# EAGLE design mezza (EAGLE 9.5.2)

## Sheet 1 of 5
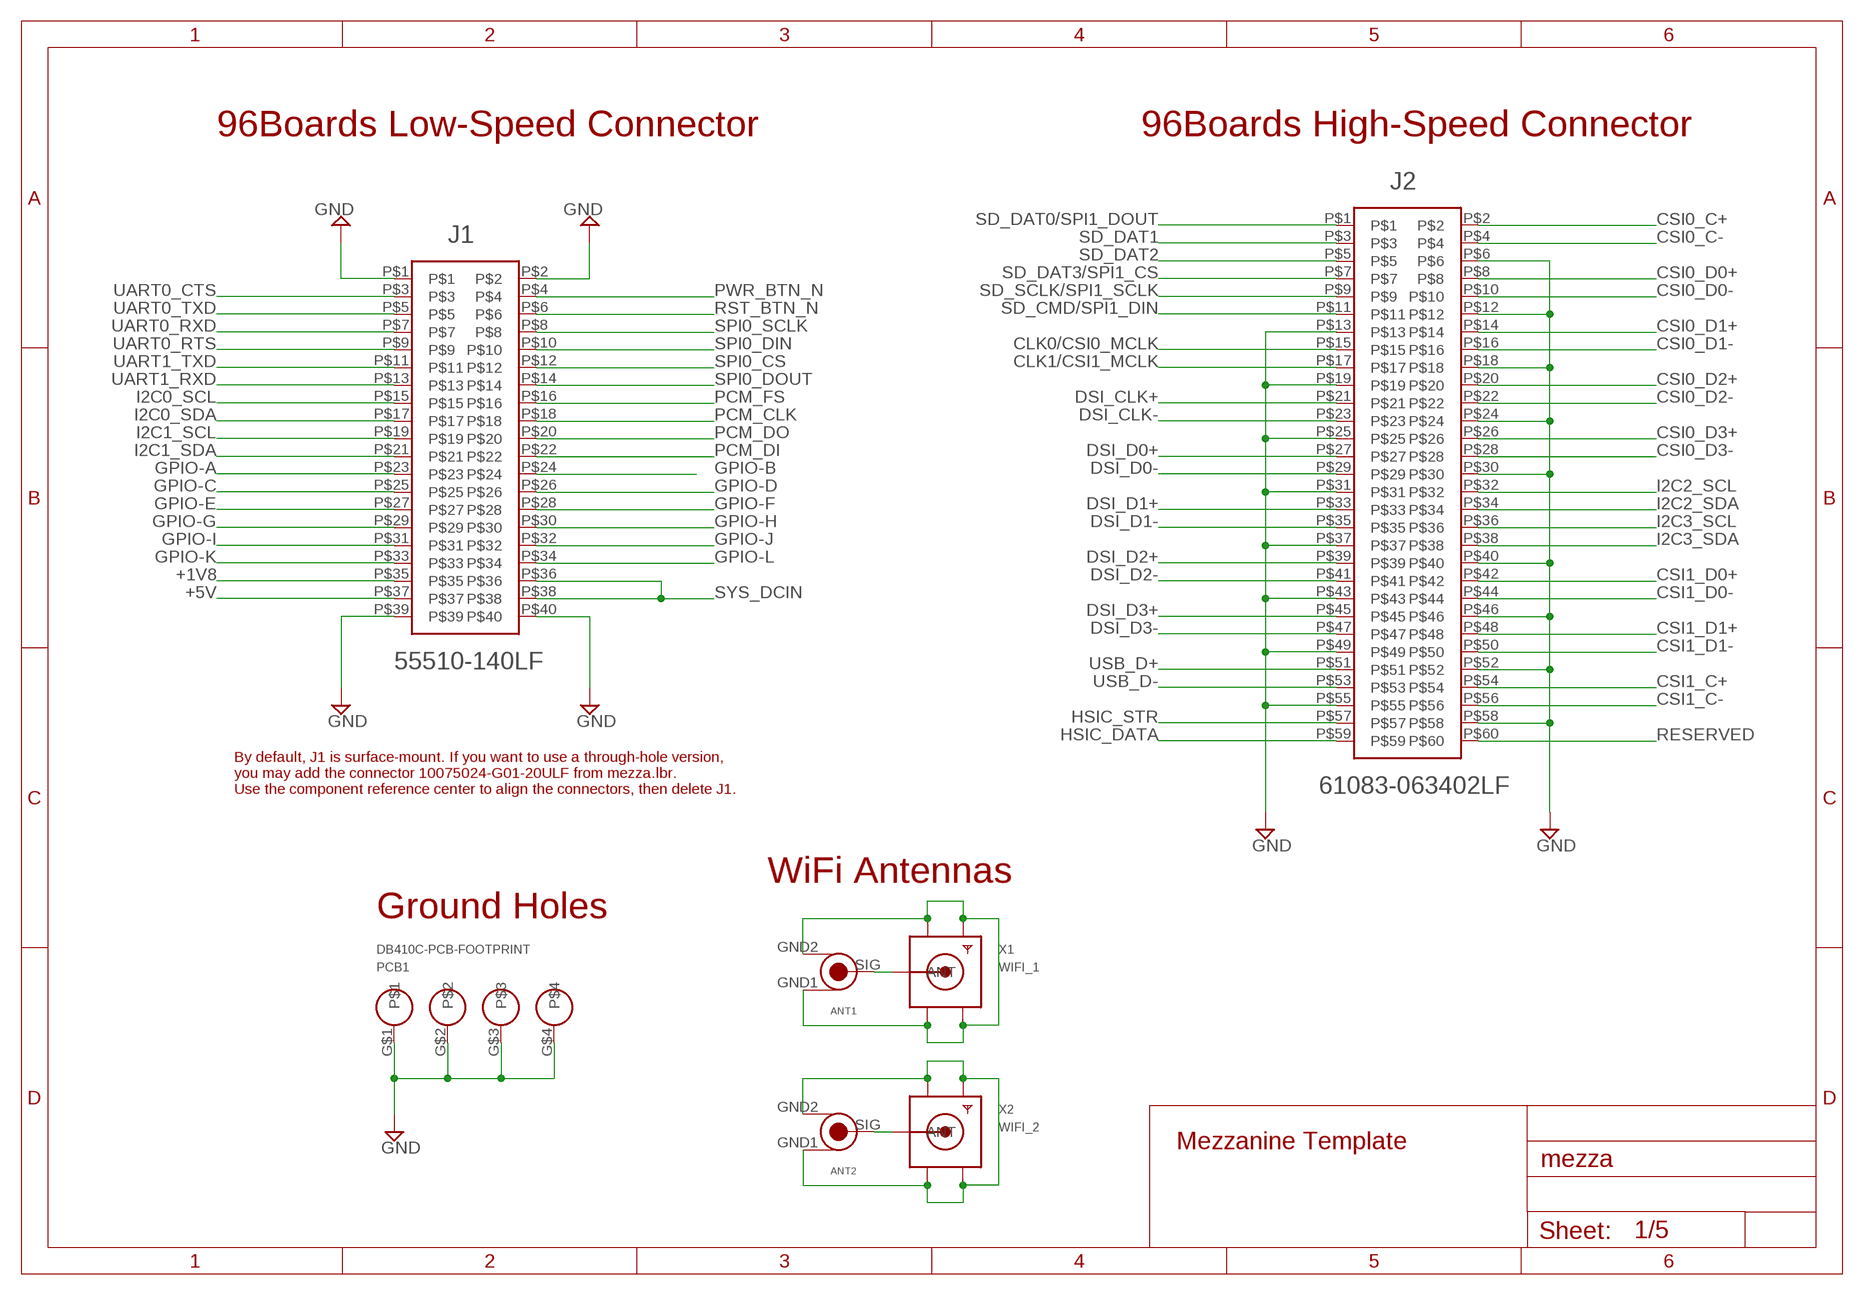
[diagram p0: schematic, sheet 1]

### Parts
ANT1  GHI-CONNECTORS_U.FL-R-SMT-1  [GHI-CONNECTORS_U.FL-R-SMT-1]
ANT2  GHI-CONNECTORS_U.FL-R-SMT-1  [GHI-CONNECTORS_U.FL-R-SMT-1]
J1  55510-140LF  [55510-140LF]
J2  61083-063402LF  [61083-063402LF]
PCB1  DB410C-PCB-FOOTPRINT  [DRAGONBOARD410C]
X1  WIFI_1  SMACONNECTOR_EDGE  [SMA_EDGELAUNCH]
X2  WIFI_2  SMACONNECTOR_EDGE  [SMA_EDGELAUNCH]

### Nets
+1V8: J1.P$35 ; also sheet 3,4,5
+5V: J1.P$37 ; also sheet 2,3,4,5
CLK0/CSI0_MCLK: J2.P$15
CLK1/CSI1_MCLK: J2.P$17
CSI0_C+: J2.P$2
CSI0_C-: J2.P$4
CSI0_D0+: J2.P$8
CSI0_D0-: J2.P$10
CSI0_D1+: J2.P$14
CSI0_D1-: J2.P$16
CSI0_D2+: J2.P$20
CSI0_D2-: J2.P$22
CSI0_D3+: J2.P$26
CSI0_D3-: J2.P$28
CSI1_C+: J2.P$54
CSI1_C-: J2.P$56
CSI1_D0+: J2.P$42
CSI1_D0-: J2.P$44
CSI1_D1+: J2.P$48
CSI1_D1-: J2.P$50
DSI_CLK+: J2.P$21
DSI_CLK-: J2.P$23
DSI_D0+: J2.P$27
DSI_D0-: J2.P$29
DSI_D1+: J2.P$33
DSI_D1-: J2.P$35
DSI_D2+: J2.P$39
DSI_D2-: J2.P$41
DSI_D3+: J2.P$45
DSI_D3-: J2.P$47
GND: J1.P$1 J1.P$2 J1.P$39 J1.P$40 J2.P$6 J2.P$12 J2.P$13 J2.P$18 J2.P$19 J2.P$24 J2.P$25 J2.P$30 J2.P$31 J2.P$37 J2.P$40 J2.P$43 J2.P$46 J2.P$49 J2.P$52 J2.P$55 J2.P$58 PCB1.G$1 PCB1.G$2 PCB1.G$3 PCB1.G$4 ; also sheet 2,3,4,5
GPIO-A: J1.P$23
GPIO-B: J1.P$24
GPIO-C: J1.P$25
GPIO-D: J1.P$26
GPIO-E: J1.P$27
GPIO-F: J1.P$28
GPIO-G: J1.P$29 ; also sheet 5
GPIO-H: J1.P$30
GPIO-I: J1.P$31 ; also sheet 5
GPIO-J: J1.P$32 ; also sheet 5
GPIO-K: J1.P$33 ; also sheet 5
GPIO-L: J1.P$34 ; also sheet 5
HSIC_DATA: J2.P$59
HSIC_STR: J2.P$57
I2C0_SCL: J1.P$15
I2C0_SDA: J1.P$17
I2C1_SCL: J1.P$19 ; also sheet 3
I2C1_SDA: J1.P$21 ; also sheet 3
I2C2_SCL: J2.P$32
I2C2_SDA: J2.P$34
I2C3_SCL: J2.P$36
I2C3_SDA: J2.P$38
N$2: ANT1.SIG X1.P(ANT)
N$10: ANT2.SIG X2.P(ANT)
N$12: ANT2.GND1 ANT2.GND2 X2.GND@1(GND4) X2.GND@2(GND3) X2.GND@3(GND2) X2.GND@4(GND1)
N$14: ANT1.GND1 ANT1.GND2 X1.GND@1(GND4) X1.GND@2(GND3) X1.GND@3(GND2) X1.GND@4(GND1)
PCM_CLK: J1.P$18
PCM_DI: J1.P$22
PCM_DO: J1.P$20
PCM_FS: J1.P$16
PWR_BTN_N: J1.P$4
RESERVED: J2.P$60
RST_BTN_N: J1.P$6 ; also sheet 5
SD_CMD/SPI1_DIN: J2.P$11
SD_DAT0/SPI1_DOUT: J2.P$1
SD_DAT1: J2.P$3
SD_DAT2: J2.P$5
SD_DAT3/SPI1_CS: J2.P$7
SD_SCLK/SPI1_SCLK: J2.P$9
SPI0_CS: J1.P$12 ; also sheet 5
SPI0_DIN: J1.P$10 ; also sheet 5
SPI0_DOUT: J1.P$14 ; also sheet 5
SPI0_SCLK: J1.P$8 ; also sheet 5
SYS_DCIN: J1.P$36 J1.P$38 ; also sheet 2
UART0_CTS: J1.P$3
UART0_RTS: J1.P$9
UART0_RXD: J1.P$7 ; also sheet 4
UART0_TXD: J1.P$5 ; also sheet 4
UART1_RXD: J1.P$13 ; also sheet 4
UART1_TXD: J1.P$11 ; also sheet 4
USB_D+: J2.P$51
USB_D-: J2.P$53

### Notes on the sheet
- 96Boards Low-Speed Connector | 96Boards High-Speed Connector
- By default, J1 is surface-mount. If you want to use a through-hole version, 
  you may add the connector 10075024-G01-20ULF from mezza.lbr.
  Use the component reference center to align the connectors, then delete J1.
- WiFi Antennas
- Ground Holes
- Mezzanine Template

## Sheet 2 of 5
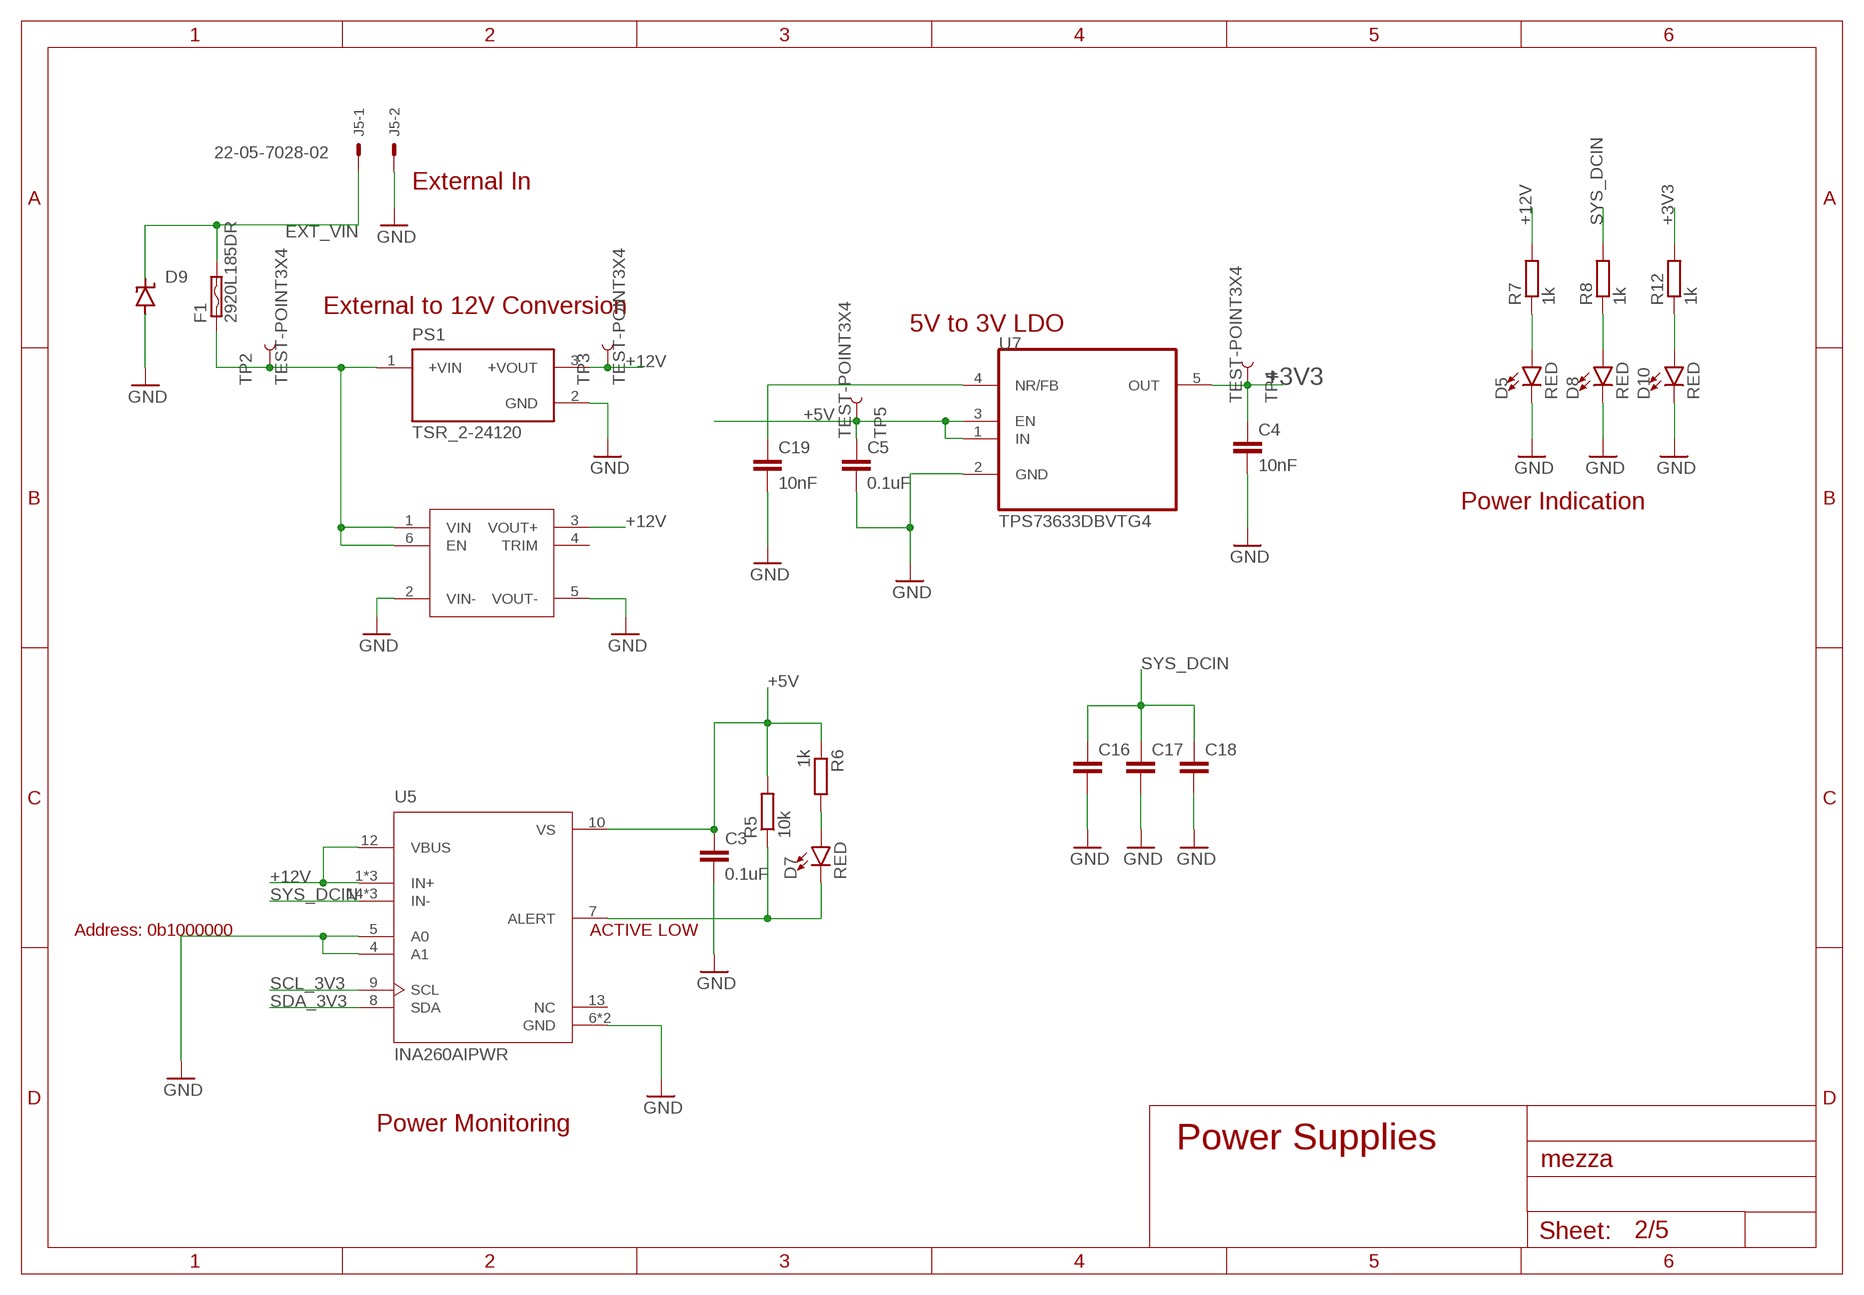
[diagram p1: schematic, sheet 2]

### Parts
C3  0.1uF  0.1UF-0603-25V-(+80/-20%)  [0603]
C4  10nF  C-EUC0603  [C0603]
C5  0.1uF  C-EUC0603  [C0603]
C16  C-EUC1206  [C1206]
C17  C-EUC1206  [C1206]
C18  C-EUC1206  [C1206]
C19  10nF  C-EUC0603  [C0603]
D5  RED  LED-RED0603  [LED-0603]
D7  RED  LED-RED0603  [LED-0603]
D8  RED  LED-RED0603  [LED-0603]
D9  SUPPRESSOR-SMBJ  [SMBJ]
D10  RED  LED-RED0603  [LED-0603]
F1  2920L185DR  2920L200  [SMD050F]
J5  22-05-7028-02  [7395-02]
PS1  TSR_2-24120  [CONV_TSR_2-24120]
R5  10k  R-EU_R0603  [R0603]
R6  1k  R-EU_R0603  [R0603]
R7  1k  R-EU_R0603  [R0603]
R8  1k  R-EU_R0603  [R0603]
R12  1k  R-EU_R0603  [R0603]
TP2  TEST-POINT3X4  [PAD.03X.04]
TP3  TEST-POINT3X4  [PAD.03X.04]
TP4  TEST-POINT3X4  [PAD.03X.04]
TP5  TEST-POINT3X4  [PAD.03X.04]
U5  INA260AIPWR  [SOP65P640X120-16N]
U7  TPS73633DBVTG4  [SOT23-5]
U$2  THN15-2422/3  THN15-2411  [TRACOTHN]

### Nets
+3V3: C4.1 R12.2 TP4.P$1 U7.5(OUT) ; also sheet 3,4
+5V: C3.1 C5.1 R5.2 R6.1 TP5.P$1 U5.10(VS) U7.1(IN) U7.3(EN) ; also sheet 1,3,4,5
+12V: PS1.3(+VOUT) R7.2 TP3.P$1 U5.1(IN+) U5.2(IN+) U5.3(IN+) U5.12(VBUS) U$2.3(VOUT+)
EXT_VIN: D9.C F1.2 J5.1
GND: C3.2 C4.2 C5.2 C16.2 C17.2 C18.2 C19.2 D5.C D8.C D9.A D10.C J5.2 PS1.2(GND) U5.4(A1) U5.5(A0) U5.6(GND) U5.11(GND) U7.2(GND) U$2.2(VIN-) U$2.5(VOUT-) ; also sheet 1,3,4,5
N$1: D7.C R5.1 U5.7(ALERT)
N$7: D7.A R6.2
N$13: D5.A R7.1
N$15: D8.A R8.1
N$16: C19.1 U7.4(NR/FB)
N$17: D10.A R12.1
N$27: F1.1 PS1.1(+VIN) TP2.P$1 U$2.1(VIN) U$2.6(EN)
SCL_3V3: U5.9(SCL) ; also sheet 3
SDA_3V3: U5.8(SDA) ; also sheet 3
SYS_DCIN: C16.1 C17.1 C18.1 R8.2 U5.14(IN-) U5.15(IN-) U5.16(IN-) ; also sheet 1
Unconnected: U5.13(NC) U$2.4(TRIM)

### Notes on the sheet
- External In
- External to 12V Conversion
- 5V to 3V LDO
- Power Indication
- Address: 0b1000000 | ACTIVE LOW
- Power Monitoring
- Power Supplies

## Sheet 3 of 5
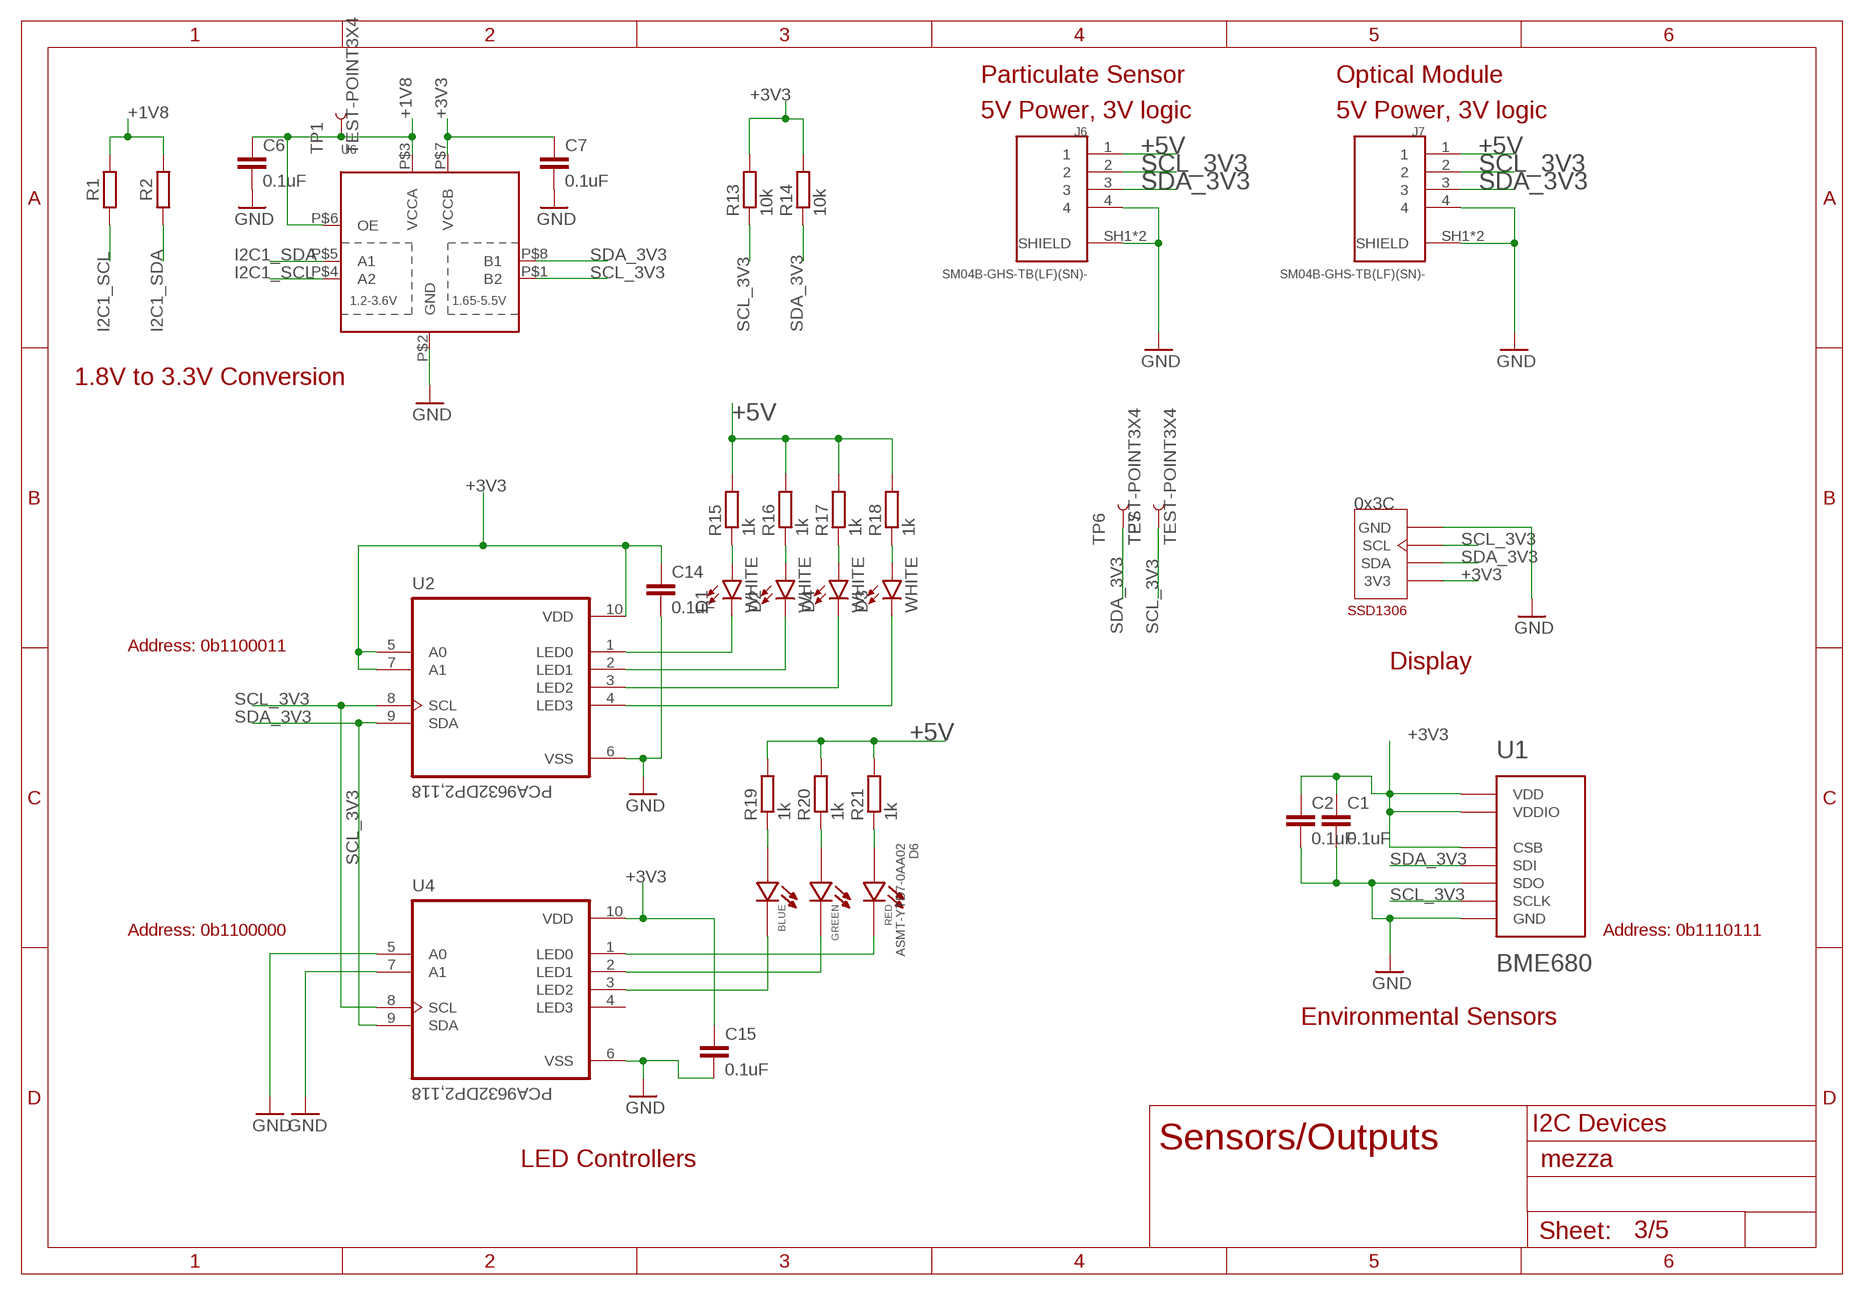
[diagram p2: schematic, sheet 3]

### Parts
C1  0.1uF  0.1UF-0603-25V-(+80/-20%)  [0603]
C2  0.1uF  0.1UF-0603-25V-(+80/-20%)  [0603]
C6  0.1uF  0.1UF-0603-25V-(+80/-20%)  [0603]
C7  0.1uF  0.1UF-0603-25V-(+80/-20%)  [0603]
C14  0.1uF  0.1UF-0603-25V-(+80/-20%)  [0603]
C15  0.1uF  0.1UF-0603-25V-(+80/-20%)  [0603]
D1  WHITE  LED-WHITE0603  [LED-0603]
D2  WHITE  LED-WHITE0603  [LED-0603]
D3  WHITE  LED-WHITE0603  [LED-0603]
D4  WHITE  LED-WHITE0603  [LED-0603]
D6  ASMT-YTD7-0AA02  [LED_ASMT-YTD7-0AA02]
J6  SM04B-GHS-TB(LF)(SN)-  [JST_SM04B-GHS-TB(LF)(SN)-]
J7  SM04B-GHS-TB(LF)(SN)-  [JST_SM04B-GHS-TB(LF)(SN)-]
R1  10k  R-EU_R0603  [R0603]
R2  10k  R-EU_R0603  [R0603]
R13  10k  R-EU_R0603  [R0603]
R14  10k  R-EU_R0603  [R0603]
R15  1k  R-EU_R0603  [R0603]
R16  1k  R-EU_R0603  [R0603]
R17  1k  R-EU_R0603  [R0603]
R18  1k  R-EU_R0603  [R0603]
R19  1k  R-EU_R0603  [R0603]
R20  1k  R-EU_R0603  [R0603]
R21  1k  R-EU_R0603  [R0603]
TP1  TEST-POINT3X4  [PAD.03X.04]
TP6  TEST-POINT3X4  [PAD.03X.04]
TP7  TEST-POINT3X4  [PAD.03X.04]
U1  BME680  [LGA-8]
U2  PCA9632DP2,118  [SOP50P490X110-10N]
U4  PCA9632DP2,118  [SOP50P490X110-10N]
U6  TXS0102  [VFSOP-8]
U$1  SSD1306  [128_32_OLED]

### Nets
+1V8: C6.1 R1.2 R2.2 TP1.P$1 U6.P$3(VCCA) U6.P$6(OE) ; also sheet 1,4,5
+3V3: C1.1 C2.1 C7.1 C14.1 C15.1 R13.2 R14.2 U1.2(CSB) U1.6(VDDIO) U1.8(VDD) U2.5(A0) U2.7(A1) U2.10(VDD) U4.10(VDD) U6.P$7(VCCB) U$1.3V3 ; also sheet 2,4
+5V: J6.1 J7.1 R15.2 R16.2 R17.2 R18.2 R19.2 R20.2 R21.2 ; also sheet 1,2,4,5
GND: C1.2 C2.2 C6.2 C7.2 C14.2 C15.2 J6.4 J6.SH1(SHIELD) J6.SH2(SHIELD) J7.4 J7.SH1(SHIELD) J7.SH2(SHIELD) U1.1(GND) U1.5(SDO) U1.7(GND) U2.6(VSS) U4.5(A0) U4.6(VSS) U4.7(A1) U6.P$2(GND) U$1.GND ; also sheet 1,2,4,5
I2C1_SCL: R1.1 U6.P$4(A2) ; also sheet 1
I2C1_SDA: R2.1 U6.P$5(A1) ; also sheet 1
N$3: D1.A R15.1
N$4: D2.A R16.1
N$5: D4.A R17.1
N$6: D3.A R18.1
N$8: D6.6(B_A) R19.1
N$9: D6.5(G_A) R20.1
N$11: D6.4(R_A) R21.1
N$21: D1.C U2.1(LED0)
N$22: D2.C U2.2(LED1)
N$25: D4.C U2.3(LED2)
N$26: D3.C U2.4(LED3)
N$28: D6.1(B_C) U4.3(LED2)
N$29: D6.2(G_C) U4.2(LED1)
N$30: D6.3(R_C) U4.1(LED0)
SCL_3V3: J6.2 J7.2 R13.1 TP7.P$1 U1.4(SCLK) U2.8(SCL) U4.8(SCL) U6.P$1(B2) U$1.SCL ; also sheet 2
SDA_3V3: J6.3 J7.3 R14.1 TP6.P$1 U1.3(SDI) U2.9(SDA) U4.9(SDA) U6.P$8(B1) U$1.SDA ; also sheet 2
Unconnected: U4.4(LED3)

### Notes on the sheet
- Particulate Sensor | Optical Module
- 5V Power, 3V logic | 5V Power, 3V logic
- 1.8V to 3.3V Conversion
- 0x3C
- Address: 0b1100011
- Display
- Address: 0b1100000 | Address: 0b1110111
- Environmental Sensors
- I2C Devices
- LED Controllers | Sensors/Outputs

## Sheet 4 of 5
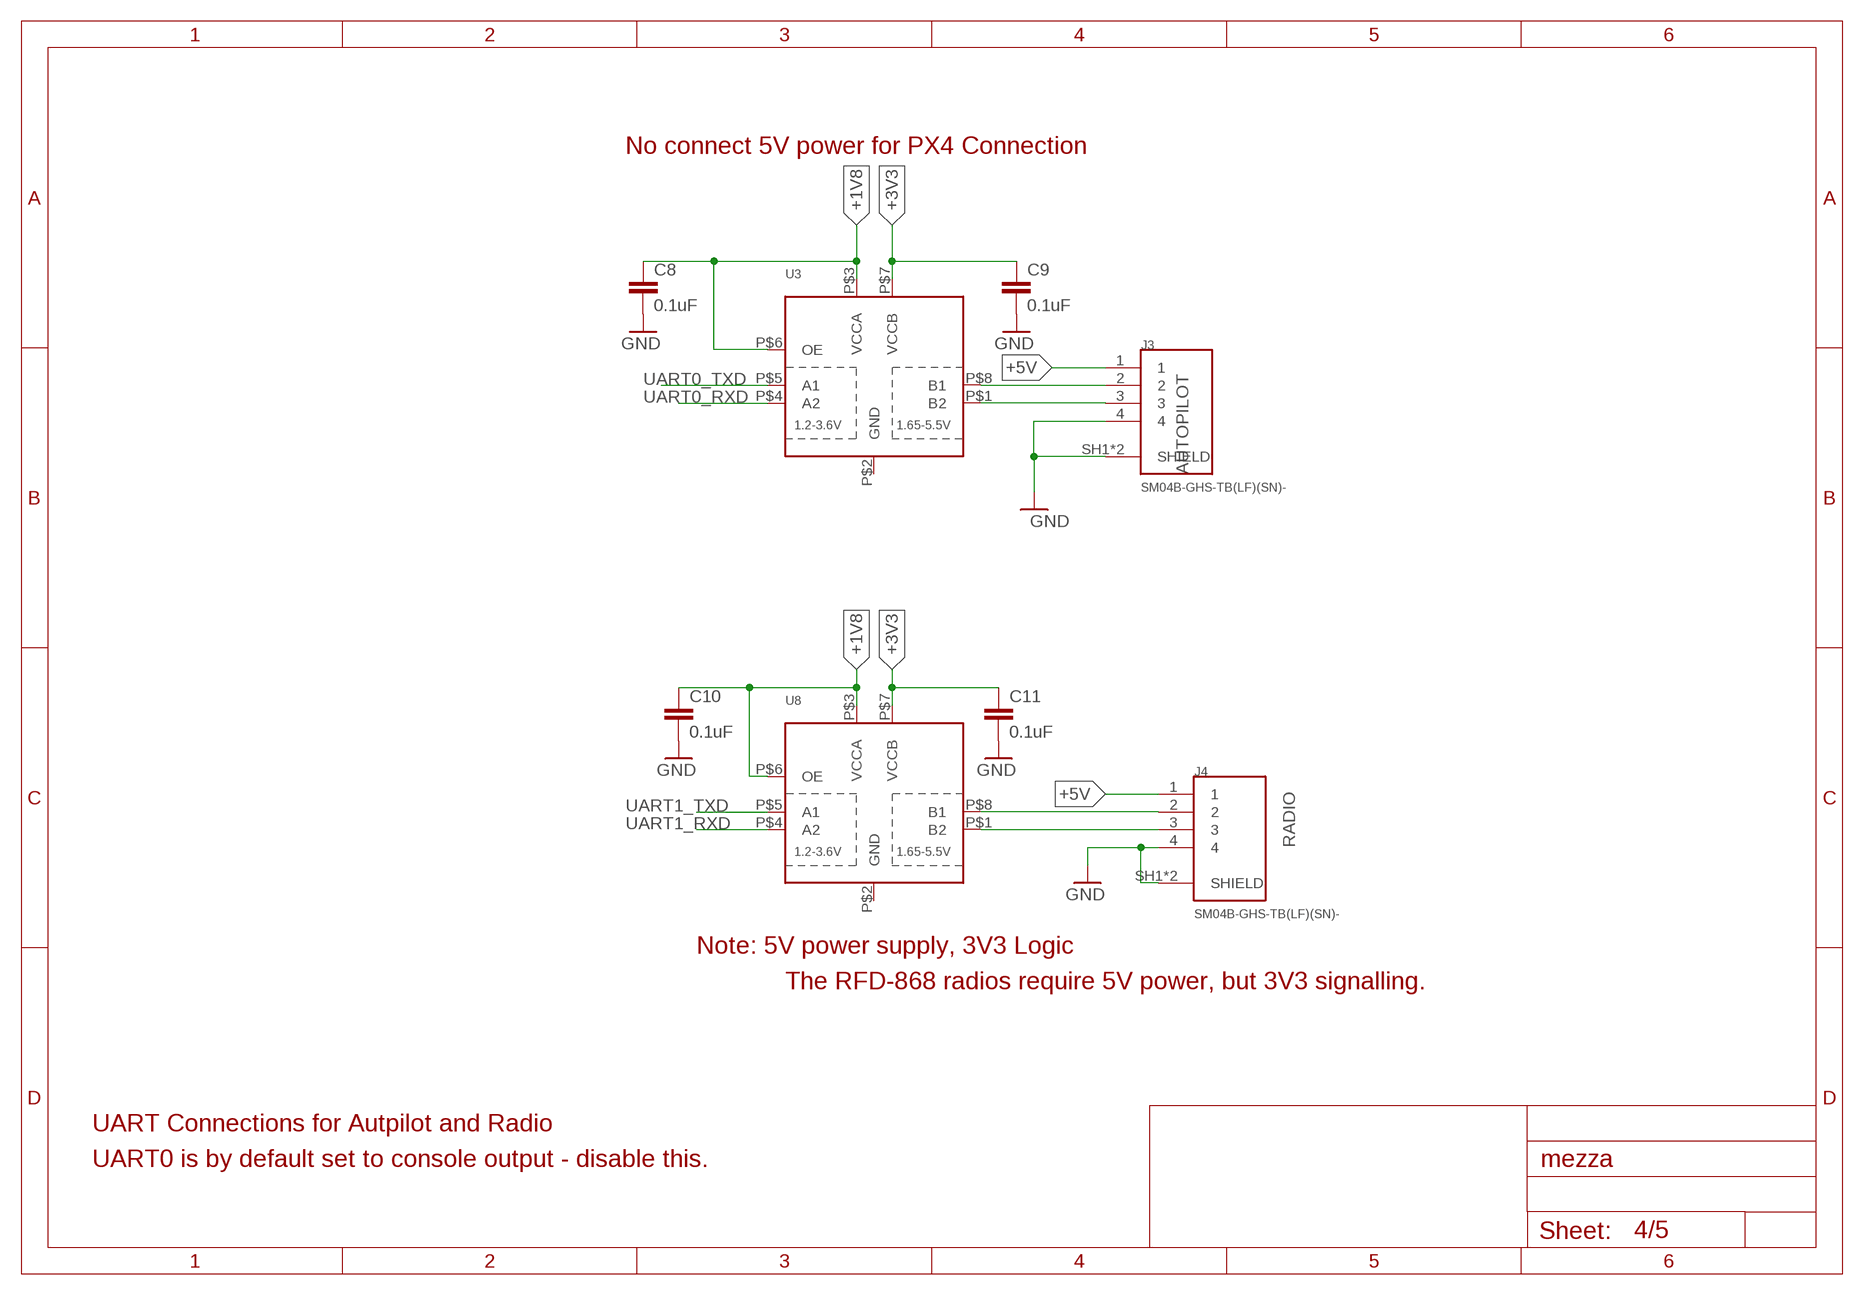
[diagram p3: schematic, sheet 4]

### Parts
C8  0.1uF  0.1UF-0603-25V-(+80/-20%)  [0603]
C9  0.1uF  0.1UF-0603-25V-(+80/-20%)  [0603]
C10  0.1uF  0.1UF-0603-25V-(+80/-20%)  [0603]
C11  0.1uF  0.1UF-0603-25V-(+80/-20%)  [0603]
J3  SM04B-GHS-TB(LF)(SN)-  [JST_SM04B-GHS-TB(LF)(SN)-]
J4  SM04B-GHS-TB(LF)(SN)-  [JST_SM04B-GHS-TB(LF)(SN)-]
U3  TXS0102  [VFSOP-8]
U8  TXS0102  [VFSOP-8]

### Nets
+1V8: C8.1 C10.1 U3.P$3(VCCA) U3.P$6(OE) U8.P$3(VCCA) U8.P$6(OE) ; also sheet 1,3,5
+3V3: C9.1 C11.1 U3.P$7(VCCB) U8.P$7(VCCB) ; also sheet 2,3
+5V: J3.1 J4.1 ; also sheet 1,2,3,5
GND: C8.2 C9.2 C10.2 C11.2 J3.4 J3.SH1(SHIELD) J3.SH2(SHIELD) J4.4 J4.SH1(SHIELD) J4.SH2(SHIELD) ; also sheet 1,2,3,5
N$23: J3.2 U3.P$8(B1)
N$24: J3.3 U3.P$1(B2)
N$31: J4.2 U8.P$8(B1)
N$34: J4.3 U8.P$1(B2)
UART0_RXD: U3.P$4(A2) ; also sheet 1
UART0_TXD: U3.P$5(A1) ; also sheet 1
UART1_RXD: U8.P$4(A2) ; also sheet 1
UART1_TXD: U8.P$5(A1) ; also sheet 1
Unconnected: U3.P$2(GND) U8.P$2(GND)

### Notes on the sheet
- No connect 5V power for PX4 Connection
- AUTOPILOT
- RADIO
- Note: 5V power supply, 3V3 Logic
- The RFD-868 radios require 5V power, but 3V3 signalling.
- UART Connections for Autpilot and Radio
- UART0 is by default set to console output - disable this.

## Sheet 5 of 5
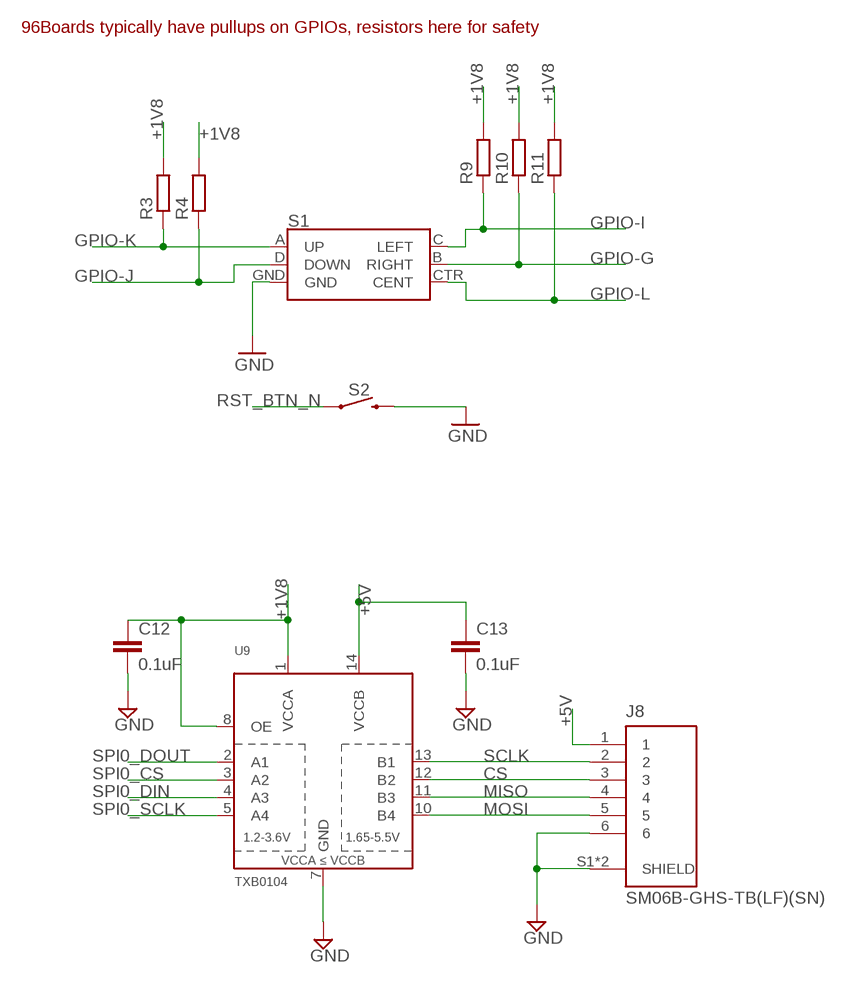
[diagram p4: schematic, sheet 5]

### Parts
C12  0.1uF  C-EUC0603  [C0603]
C13  0.1uF  C-EUC0603  [C0603]
J8  SM06B-GHS-TB(LF)(SN)  [JST_SM06B-GHS-TB(LF)(SN)]
R3  R-EU_R0603  [R0603]
R4  R-EU_R0603  [R0603]
R9  R-EU_R0603  [R0603]
R10  R-EU_R0603  [R0603]
R11  R-EU_R0603  [R0603]
S1  JOYSTICK_MINI  [JOYSTICK_MINI]
S2  MOMENTARY-SWITCH-SPST-SMD-6.2MM-TALL  [TACTILE_SWITCH_SMD_6.2MM_TALL]
U9  TXB0104  TXB0104PWR  [TSSOP14]

### Nets
+1V8: C12.1 R3.2 R4.2 R9.2 R10.2 R11.2 U9.1(VCCA) U9.8(OE) ; also sheet 1,3,4
+5V: C13.1 J8.1 U9.14(VCCB) ; also sheet 1,2,3,4
CS: J8.3 U9.12(B2)
GND: C12.2 C13.2 J8.6 J8.S1(SHIELD) J8.S2(SHIELD) S1.GND S2.B2 U9.7(GND) ; also sheet 1,2,3,4
GPIO-G: R10.1 S1.B(RIGHT) ; also sheet 1
GPIO-I: R9.1 S1.C(LEFT) ; also sheet 1
GPIO-J: R4.1 S1.D(DOWN) ; also sheet 1
GPIO-K: R3.1 S1.A(UP) ; also sheet 1
GPIO-L: R11.1 S1.CTR(CENT) ; also sheet 1
MISO: J8.4 U9.11(B3)
MOSI: J8.5 U9.10(B4)
RST_BTN_N: S2.A2 ; also sheet 1
SCLK: J8.2 U9.13(B1)
SPI0_CS: U9.3(A2) ; also sheet 1
SPI0_DIN: U9.4(A3) ; also sheet 1
SPI0_DOUT: U9.2(A1) ; also sheet 1
SPI0_SCLK: U9.5(A4) ; also sheet 1

### Notes on the sheet
- 96Boards typically have pullups on GPIOs, resistors here for safety

## Library data of the parts
ANT1 ANT2 = BeagleBone_Black_Wireless:GHI-CONNECTORS_U.FL-R-SMT-1
C1-C3 C6-C11 C14 C15 = SparkFun-Capacitors:0.1UF: 0.1µF ceramic capacitors A capacitor is a passive two-terminal electrical component used to store electrical energy temporarily in an electric field.; PROD_ID: CAP-00810
C4 C5 C19 = rcl:C-EU: CAPACITOR, European symbol; SPICEPREFIX: C
C12 C13 C16-C18 = resistor:C-EU: CAPACITOR, European symbol
D1-D4 = SparkFun-LED:LED-WHITE: White SMD LED Used in manufacturing several products at SparkFun. Packages: 0603 - Bright White SMD 0603 package[Product Link] <http://www.kingbrightusa.com/product.asp?catalog_name=LED&product_id=APT1608QWF/D> 1206 - Bright White SMD1206 package [Product Link] <http://www.kingbrightusa.com/product.asp?catalog_name=LED&product_id=APT3216QWF/D> 3014 - Super Bright SMD 3014 package [Datasheet] <http://www.lumileds.com/uploads/459/DS208-pdf> SparkFun Products: Blackberry Trackballer Breakout <https://www.sparkfun.com/products/13169> Digital SandBox <https://www.sparkfun.com/products/12651>; PROD_ID: DIO-09004
D5 D7 D8 D10 = SparkFun-LED:LED-RED: Red SMD LED Used in manufacturing of most products at SparkFun Packages: 0603 - SMD 0603 package [Product Link] <http://docs.avagotech.com/docs/AV02-0551EN> 0603 SMART - SMD 0603 SMART package ( more efficient and expensive)[Product Link] <http://www.osram-os.com/Graphics/XPic2/00077099_0.pdf> 1206 - SMD1206 package [Product Link] <https://www.sparkfun.com/datasheets/DevTools/LilyPad/Q150OVS4.pdff> SparkFun Products: Pro Mini 328 -5V <https://www.sparkfun.com/products/821> RedBoard <https://www.sparkfun.com/products/12757> IOIO-OTG <https://www.sparkfun.com/products/13613>; PROD_ID: DIO-00819
D6 = ASMT-YTD7-0AA02:ASMT-YTD7-0AA02: SMD LED RGB 1.8...3.6 V PLCC-6 | Broadcom ASMTYTD70AA02 @ LED, SMD (SMD LED RGB 1.8...3.6 V PLCC-6 LEDs – SMD).; DESCRIPTION: Red, Green, Blue _RGB_ 623nm Red, 529nm Green, 469nm Blue LED Indication - Discrete 2.1V Red, 3.1V Green, 3.1V Blue 6-SMD, J-Lead; DIGI-KEY_PART_NUMBER: 516-3219-1-ND; DIGI-KEY_PURCHASE_URL: https://www.digikey.com/product-detail/en/broadcom-limited/ASMT-YTD7-0AA02/516-3219-1-ND/5277752?utm_source=snapeda&utm_medium=aggregator&utm_campaign=symbol; MF: Broadcom Limited; MP: ASMT-YTD7-0AA02; PACKAGE: PLCC-6 Broadcom
D9 = diode:SUPPRESSOR-: Suppressor diode
F1 = 2920L200:2920L200: PolySwitch (TM) Resettable Device Source: Data sheet <http://www.farnell.com/datasheets/13482.pdf>; AVAILABILITY: Unavailable; DESCRIPTION: Polymeric PTC Resettable Fuse 24V 2A Ih Surface Mount 2920 _7351 Metric_, Concave; MF: Littelfuse Inc.; MP: 2920L200; PACKAGE: 2920 Littelfuse Inc.; PRICE: None
J1 = mezza:55510-140LF: 55510-140LF MANUFACTURER : Amphenol FCI DESCRIPTION Conn Socket Strip SKT 40 POS 2mm Solder ST SMD Tube Note: DragonBoard 410c LS Connector Think of FCI's socket strip 55510-140LF header connector the next time you're concerned about accidentally shorting out pins on your printed circuit. This SKT connector's 40 contacts that are made out of phosphor bronze and plated with gold over nickel. It has a socket type gender. It has a straight body orientation. Its pitch is 2 mm. This is a 2-row connector. It has a maximum voltage rating of 200 VDC|200VAC. This device has a maximum current rating of 1 A/contact. In order to ensure parts aren't damaged by bulk packaging, this product comes in tube packaging to add a little more protection by storing the loose parts in an outer tube. This connector has an operating temperature of -55 to 125 °C. This product is 39.92 mm long, 4.5 mm tall and 4 mm deep. 55510-140LF is housed in black plastic. It uses the solder termination method.
J2 = mezza:61083-063402LF: 61083-063402LF Amphenol FCI 61083-063402LF Connector Headers and PCB Receptacles MANUFACTURER : Amphenol FCI DESCRIPTION : Conn Fine Pitch Connector PL 60 POS 0.8mm Solder ST SMD T/R Note: DragonBoard 410c HS Connector This fine pitch connector 61083-063402LF header connector from FCI reduces the possibility of accidentally shorting pins when a board is being used. This PL connector's 60 contacts that are made out of brass and plated with gold over nickel. It has a plug type gender. Its pitch is 0.8 mm. It has a straight body orientation. It has a maximum voltage rating of 100 VAC. This is a 2-row connector. This device has a maximum current rating of 0.8 A/contact. Tape and reel packaging will encase the product during shipment, ensuring safe delivery and enabling quick mounting of components. This product is 29.8 mm long, 6.7 mm tall and 6 mm deep. 61083-063402LF is housed in liquid crystal polymer. It uses the solder termination method. This connector has an operating temperature of -40 to 125 °C.
J3 J4 J6 J7 = SM04B-GHS-TB_LF__SN_-:SM04B-GHS-TB(LF)(SN)-: Conn Header Gh Side 4pos 1.25mm; DESCRIPTION: Conn Header Gh Side 4pos 1.25mm; DIGI-KEY_PART_NUMBER: 455-1566-1-ND; DIGI-KEY_PURCHASE_URL: https://www.digikey.com/product-detail/en/jst-sales-america-inc/SM04B-GHS-TB_LF__SN_-/455-1566-1-ND/807834?utm_source=snapeda&utm_medium=aggregator&utm_campaign=symbol; MF: JST Sales; MP: SM04B-GHS-TB_LF__SN_-; PACKAGE: None
J5 = con-molex:22-?-02: CONNECTOR wire to board 2.54 mm (.1 inch) pitch header; MF: MOLEX; OC_FARNELL: 9731601; OC_NEWARK: unknown
J8 = SM06B-GHS-TB_LF__SN_:SM06B-GHS-TB(LF)(SN): GHS Series 1.25 mm Pitch Disc. Crimp Wire-to-Wire Connector; AVAILABILITY: Unavailable; DESCRIPTION: Connector Header Surface Mount, Right Angle 6 position 0.049 _1.25mm_; MF: JST Sales; MP: SM06B-GHS-TB_LF__SN_; PACKAGE: None; PRICE: None
PCB1 = mezza:DB410C-PCB-FOOTPRINT
PS1 = TSR_2-24120:TSR_2-24120: Linear Regulator Replacement DC DC Converter 1 Output 12V 2A 15V - 36V Input; AVAILABILITY: Unavailable; DESCRIPTION: Linear Regulator Replacement DC DC Converter 1 Output 12V 2A 15V - 36V Input; MF: Traco Power; MP: TSR 2-24120; PACKAGE: SIP-3 Traco Power; PRICE: None
R1 R2 R5-R8 R12-R21 = rcl:R-EU_: RESISTOR, European symbol; SPICEPREFIX: R
R3 R4 R9-R11 = resistor:R-EU_: RESISTOR, European symbol
S1 = SparkFun-Switches:JOYSTICK_MINI: Small Tactile Joystick w/ Select Switch A 5-way tactile switch allows for a joystick-like interface in a very small package. Part #: 4UCON SF303GJ26 SparkFun Products 5-way Tactile Switch <https://www.sparkfun.com/products/10063> (COM-10063) Used on SparkFun Block for Intel® Edison - OLED <https://www.sparkfun.com/products/13035> (DEV-13035) Used on CAN-BUS Shield <https://www.sparkfun.com/products/13262> (DEV-13262); PROD_ID: SWCH-09905; SF_SKU: COM-10063
S2 = SparkFun-Switches:MOMENTARY-SWITCH-SPST: Momentary Switch (Pushbutton) - SPST Normally-open (NO) SPST momentary switches (buttons, pushbuttons). Variants PTH-12MM - 12mm square, through-hole Momentary Pushbutton Switch - 12mm Square <https://www.sparkfun.com/products/9190> (COM-09190) PTH-6.0MM, PTH-6.0MM-KIT - 6.0mm square, through-hole Mini Pushbutton Switch <https://www.sparkfun.com/products/97> (COM-00097) KIT package intended for soldering kit's - only one side of pads' copper is exposed. PTH-RIGHT-ANGLE-KIT - Right-angle, through-hole Right Angle Tactile Button <https://www.sparkfun.com/products/10791> - Used on SparkFun BigTime Watch Kit <https://www.sparkfun.com/products/11734> SMD-12MM - 12mm square, surface-mount Tactile Button - SMD (12mm) <https://www.sparkfun.com/products/12993> (COM-12993) Used on SparkFun PicoBoard <https://www.sparkfun.com/products/11888> SMD-4.5MM - 4.5mm Square Trackball Switch Used on SparkFun Blackberry Trackballer Breakout <https://www.sparkfun.com/products/13169> SMD-4.6MMX2.8MM - 4.60mm x 2.80mm, surface mount Used on SparkFun SAMD21 Mini Breakout <https://www.sparkfun.com/products/13664> SMD-5.2MM, SMD-5.2-REDUNDANT - 5.2mm square, surface-mount Mini Pushbutton Switch - SMD <https://www.sparkfun.com/products/8720> (COM-08720) Used on Arduino Pro Mini <https://www.sparkfun.com/products/11114> REDUNDANT package connects both switch circuits together SMD-6.0X3.5MM - 6.0 x 3.5mm, surface mount Momentary Reset Switch SMD <https://www.sparkfun.com/products/8229> (COM-08229) SMD-6.2MM-TALL - 6.2mm square, surface mount Tactile Button - SMD (6mm) <https://www.sparkfun.com/products/12992> Used on SparkFun Digital Sandbox <https://www.sparkfun.com/products/12651> SMD-RIGHT-ANGLE - Right-angle, surface mount Used on SparkFun Block for Intel® Edison - Arduino <https://www.sparkfun.com/products/13036>; PROD_ID: SWCH-11966; SF_SKU: COM-12992
TP1-TP7 = SparkFun-Connectors:TEST-POINT: SparkFun Test Points Bare copper test points for troubleshooting or In-Circuit-Testing. These are used by our Production team for verifying production board runs using pogo-pins on test beds. SparkFun Products: SparkFun LSM9DS1 Breakout <https://www.sparkfun.com/products/13284> SparkFun PSOC <https://www.sparkfun.com/products/13714> SparkFun Load Cell Amplifier <https://www.sparkfun.com/products/13879>
U1 = BME680:BME680
U2 U4 = PCA9632DP2_118:PCA9632DP2,118: PCA9632 Series 4-Bit Fm+ I2C-Bus Low Power LED Driver - TSSOP - 10; AVAILABILITY: Unavailable; DESCRIPTION: LED Driver IC 4 Output Power Switch PWM Dimming 25mA 10-TSSOP; MF: NXP USA; MP: PCA9632DP2,118; PACKAGE: TSSOP-10 NXP Semiconductors; PRICE: None
U3 U6 U8 = adafruit:TXS0102: 2-Bit Bi-Directional Level Shifter (I2C, etc.) Designed for I2C devices and has internal pullups. Not to be confused with TXB010x series. 1.2V-3.6V (VCCA) to 1.65V-5.5V (VCCB) bi-directional level shifter with auto direction sensing. Max data rate - 24Mbps (Push Pull), 2Mbps (Open Drain) Digikey: 296-21931-1-ND
U5 = INA260AIPWR:INA260AIPWR: High/Low-Side Digital Current/Power Monitor with Integrated 2mΩ Shunt Resistor 16-TSSOP -40 to 125; AVAILABILITY: Unavailable; DESCRIPTION: Current Monitor Regulator High/Low-Side 10mA 16-TSSOP; MF: Texas Instruments; MP: INA260AIPWR; PACKAGE: TSSOP-16 Texas Instruments; PRICE: None
U7 = TPS73633:TPS73633: Low-Dropout Regulator; AVAILABILITY: Unavailable; DESCRIPTION: Single Output LDO 400-mA Fixed _3.3 V_ Cap-Free Low-Noise Reverse Current Protection; MF: Texas Instruments; MP: TPS73633; PACKAGE: SOT-23 Texas Instruments; PRICE: None
U9 = SparkFun-IC-Comms:TXB0104PWR: 4-Bit Bi-Directional Level Shifter 1.2V-3.6V (VCCA) to 1.65V-5.5V (VCCB) bi-directional level shifter with auto direction sensing. Max data rate - VCCA 1.8V: 20Mbps (50ns), VCCA 3.3V: 100Mbps (10ns) Digikey: 296-21929-1-ND (TSSOP) Datasheet <http://cdn.sparkfun.com/datasheets/BreakoutBoards/txb0104.pdf> SparkFun Products SparkFun Cellular Shield - MG2639 <https://www.sparkfun.com/products/13120> (CEL-13120) SparkFun Level Shifting microSD Breakout <https://www.sparkfun.com/products/13743> (DEV-13743) SparkFun Voltage-Level Translator Breakout - TXB0104 <https://www.sparkfun.com/products/11771> (BOB-11771) SparkFun Block for Intel® Edison - UART <https://www.sparkfun.com/products/13040> (DEV-13040) SparkFun Block for Intel® Edison - Arduino <https://www.sparkfun.com/products/13036> (DEV-13036); PROD_ID: NA-XXXXX
U$1 = ssd1306_oled:SSD1306
U$2 = traco:THN15-2411
X1 X2 = adafruit:SMACONNECTOR: SMA Connector 90° DIP SMA Connector, 50 Ohm (4UConnector: 07259); LABEL: WIFI

## Board
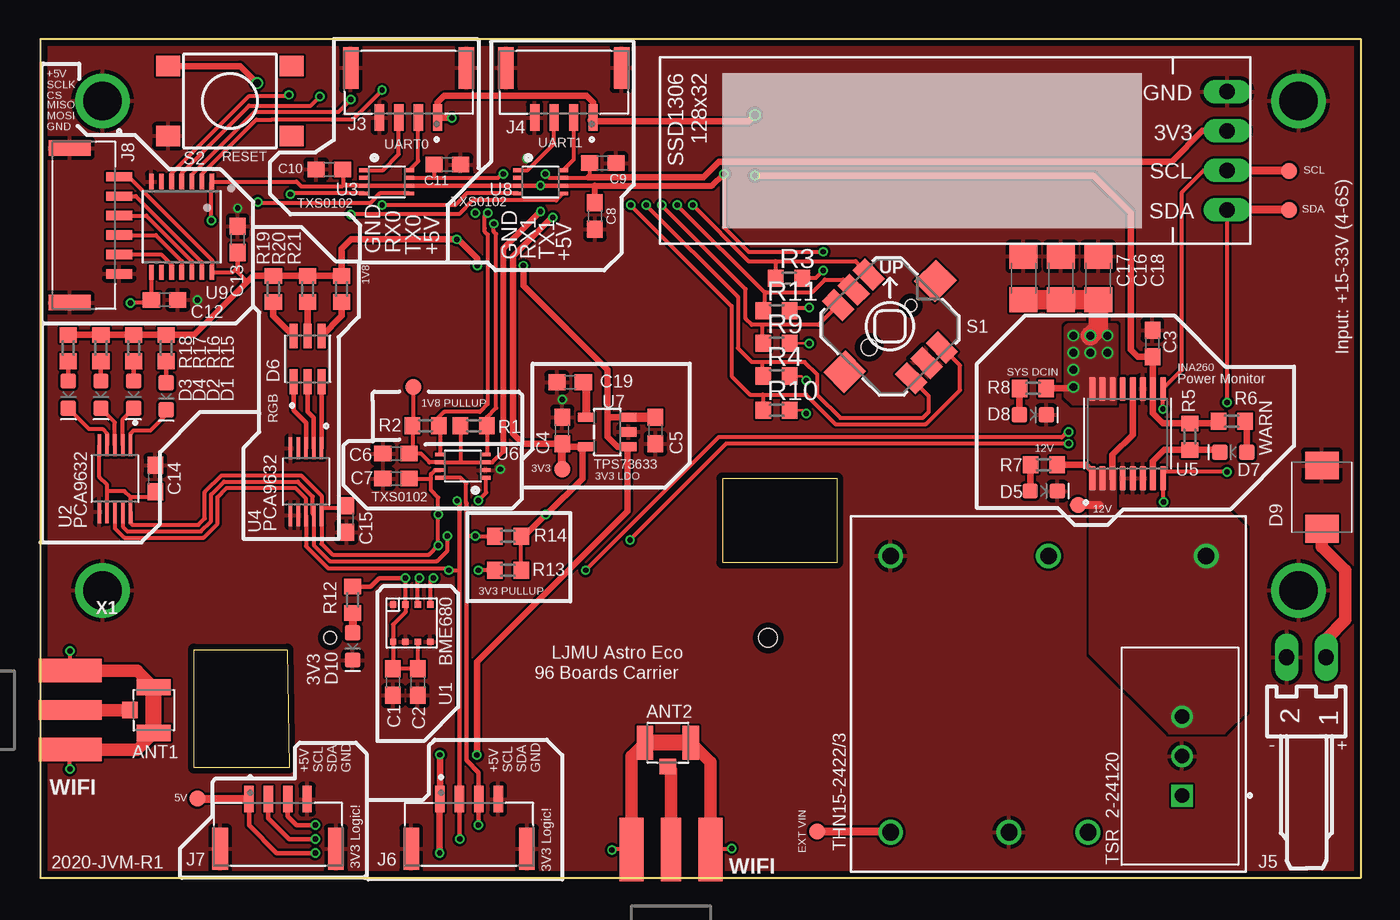
[diagram p5: board, top side]
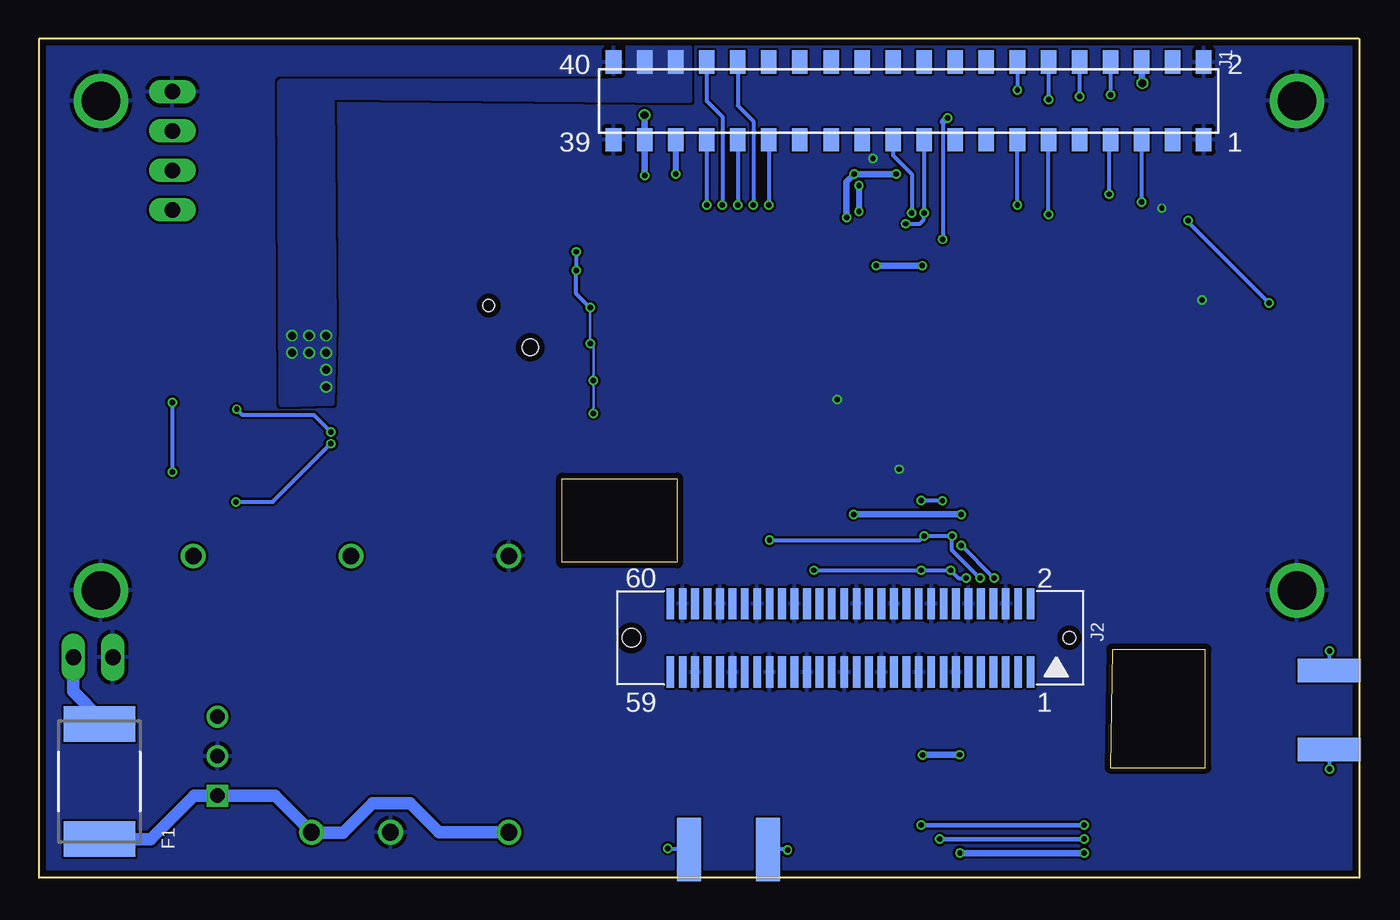
[diagram p6: board, bottom side, seen from below]

Size 85 x 54 mm. Coordinates in mm from the lower left corner, seen from the top.
Outline: 9.9,14.7 15.9,14.7 16,7.1 9.9,7.1 9.9,14.7
Outline: 43.9,25.7 43.9,20.3 51.3,20.3 51.3,25.7 43.9,25.7
Copper layers (1*16): Top 0.035559375mm / dielectric 1.6mm / Bottom 0.035559375mm
Design rules "oshpark-2layer *": minimum track width 6mil, minimum drill 10mil, track to track 6mil, track to pad 6mil, pad to pad 6mil, via to via 6mil, smd to smd 6mil, copper to edge 15mil, drill to drill 6mil, minimum pad ring 5mil, minimum via ring 5mil, stop-mask expansion 2.5mil, vias tented up to drill 20mil, thermal gap 10mil
bKeepout: area 16,0 to 34,11; area 48,0 to 85,15.7; area 68,40.2 to 78.7,54

### Footprints (pad centres in the part's own frame; a part is rotated, then mirrored left to right if it is on the bottom)
GHI-CONNECTORS_U.FL-R-SMT-1 = smd 1.05 x 2.2: GND1 -1.475,0; GND2 1.475,0 | smd 1.05 x 1: SIG 0,-1.525
0603 = smd 1.1 x 1: 1 -0.85,0; 2 0.85,0
C0603 = smd 1.1 x 1: 1 -0.85,0; 2 0.85,0
C1206 = smd 1.6 x 1.8: 1 -1.4,0; 2 1.4,0
LED-0603 = smd 1 x 1: A -0.877,0; C 0.877,0
LED_ASMT-YTD7-0AA02 = smd 1.6 x 0.5: 1 -1.475,0.9; 2 -1.475,0; 3 -1.475,-0.9; 4 1.475,-0.9; 5 1.475,0; 6 1.475,0.9
SMBJ = smd 1.78 x 2.16: A 2.04,0; C -2.03,0
SMD050F = smd 2.3 x 4.6: 1 -3.7,0; 2 3.7,0
55510-140LF = smd 1 x 1.5: P$1 -19,2.5; P$2 -19,-2.5; P$3 -17,2.5; P$4 -17,-2.5; P$5 -15,2.5; P$6 -15,-2.5; P$7 -13,2.5; P$8 -13,-2.5; P$9 -11,2.5; P$10 -11,-2.5; P$11 -9,2.5; P$12 -9,-2.5; P$13 -7,2.5; P$14 -7,-2.5; P$15 -5,2.5; P$16 -5,-2.5; P$17 -3,2.5; P$18 -3,-2.5; P$19 -1,2.5; P$20 -1,-2.5; P$21 1,2.5; P$22 1,-2.5; P$23 3,2.5; P$24 3,-2.5; P$25 5,2.5; P$26 5,-2.5; P$27 7,2.5; P$28 7,-2.5; P$29 9,2.5; P$30 9,-2.5; P$31 11,2.5; P$32 11,-2.5; P$33 13,2.5; P$34 13,-2.5; P$35 15,2.5; P$36 15,-2.5; P$37 17,2.5; P$38 17,-2.5; P$39 19,2.5; P$40 19,-2.5
61083-063402LF = smd 0.5 x 2: P$1 -11.6,2.2; P$2 -11.6,-2.2; P$3 -10.8,2.2; P$4 -10.8,-2.2; P$5 -10,2.2; P$6 -10,-2.2; P$7 -9.2,2.2; P$8 -9.2,-2.2; P$9 -8.4,2.2; P$10 -8.4,-2.2; P$11 -7.6,2.2; P$12 -7.6,-2.2; P$13 -6.8,2.2; P$14 -6.8,-2.2; P$15 -6,2.2; P$16 -6,-2.2; P$17 -5.2,2.2; P$18 -5.2,-2.2; P$19 -4.4,2.2; P$20 -4.4,-2.2; P$21 -3.6,2.2; P$22 -3.6,-2.2; P$23 -2.8,2.2; P$24 -2.8,-2.2; P$25 -2,2.2; P$26 -2,-2.2; P$27 -1.2,2.2; P$28 -1.2,-2.2; P$29 -0.4,2.2; P$30 -0.4,-2.2; P$31 0.4,2.2; P$32 0.4,-2.2; P$33 1.2,2.2; P$34 1.2,-2.2; P$35 2,2.2; P$36 2,-2.2; P$37 2.8,2.2; P$38 2.8,-2.2; P$39 3.6,2.2; P$40 3.6,-2.2; P$41 4.4,2.2; P$42 4.4,-2.2; P$43 5.2,2.2; P$44 5.2,-2.2; P$45 6,2.2; P$46 6,-2.2; P$47 6.8,2.2; P$48 6.8,-2.2; P$49 7.6,2.2; P$50 7.6,-2.2; P$51 8.4,2.2; P$52 8.4,-2.2; P$53 9.2,2.2; P$54 9.2,-2.2; P$55 10,2.2; P$56 10,-2.2; P$57 10.8,2.2; P$58 10.8,-2.2; P$59 11.6,2.2; P$60 11.6,-2.2 | hole 1.2: 14.1,0 | hole 0.8: -14.1,0
JST_SM04B-GHS-TB(LF)(SN)- = smd 0.6 x 1.7: 1 -1.875,2.275; 2 -0.625,2.275; 3 0.625,2.275; 4 1.875,2.275 | smd 1 x 2.7: SH1 -3.725,-0.925; SH2 3.725,-0.925
7395-02 = drill 1.016 long: 1 1.27,0; 2 -1.27,0
JST_SM06B-GHS-TB(LF)(SN) = smd 0.6 x 1.7: 1 -3.125,1.875; 2 -1.875,1.875; 3 -0.625,1.875; 4 0.625,1.875; 5 1.875,1.875; 6 3.125,1.875 | smd 1 x 2.7: S1 -4.975,-1.325; S2 4.975,-1.325
DRAGONBOARD410C = drill 2.5: G$1 4,18.5; G$2 81,18.5; G$3 81,50; G$4 4,50
CONV_TSR_2-24120 = drill 0.94 pad 1.41 square: 1 0,0 | drill 0.94 pad 1.41: 2 2.54,0; 3 5.08,0
R0603 = smd 1 x 1.1: 1 -0.85,0; 2 0.85,0
JOYSTICK_MINI = smd 1.85 x 1.1: A -3.325,1.4; B 3.325,1.4; C -3.325,-1.4; CTR -3.325,0; D 3.325,-1.4; GND 3.325,0 | smd 1.9 x 2: NC 0,4.13; NC@0 0,-4.13 | hole 0.75: 0,1.9 | hole 1.05: 0,-1.9
TACTILE_SWITCH_SMD_6.2MM_TALL = smd 1.55 x 1.3: A1 -3.975,-2.25; A2 3.975,-2.25; B1 -3.975,2.25; B2 3.975,2.25
PAD.03X.04 = smd 1.016 x 1.016: P$1 0,0
LGA-8 = smd 0.4 x 0.4: 1 1.2,1.2; 2 1.2,0.4; 3 1.2,-0.4; 4 1.2,-1.2; 5 -1.2,-1.2; 6 -1.2,-0.4; 7 -1.2,0.4; 8 -1.2,1.2
SOP50P490X110-10N = smd 1.44 x 0.3: 1 -2.145,1; 2 -2.145,0.5; 3 -2.145,0; 4 -2.145,-0.5; 5 -2.145,-1; 6 2.145,-1; 7 2.145,-0.5; 8 2.145,0; 9 2.145,0.5; 10 2.145,1
VFSOP-8 = smd 0.25 x 0.65: P$1 -0.75,-1.45; P$2 -0.25,-1.45; P$3 0.25,-1.45; P$4 0.75,-1.45; P$5 0.75,1.45; P$6 0.25,1.45; P$7 -0.25,1.45; P$8 -0.75,1.45
SOP65P640X120-16N = smd 1.57 x 0.41: 1 -2.87,2.275; 2 -2.87,1.625; 3 -2.87,0.975; 4 -2.87,0.325; 5 -2.87,-0.325; 6 -2.87,-0.975; 7 -2.87,-1.625; 8 -2.87,-2.275; 9 2.87,-2.275; 10 2.87,-1.625; 11 2.87,-0.975; 12 2.87,-0.325; 13 2.87,0.325; 14 2.87,0.975; 15 2.87,1.625; 16 2.87,2.275
SOT23-5 = smd 1.05 x 0.6: 1 -1.35,0.95; 2 -1.35,0; 3 -1.35,-0.95; 4 1.35,-0.95; 5 1.35,0.95
TSSOP14 = smd 0.305 x 0.991: 1 -1.95,-2.918; 2 -1.3,-2.918; 3 -0.65,-2.918; 4 0,-2.918; 5 0.65,-2.918; 6 1.3,-2.918; 7 1.95,-2.918; 8 1.95,2.918; 9 1.3,2.918; 10 0.65,2.918; 11 0,2.918; 12 -0.65,2.918; 13 -1.3,2.918; 14 -1.95,2.918
128_32_OLED = drill 1.016 long: 3V3 1.5,4.73; GND 1.5,2.19; SCL 1.5,7.27; SDA 1.5,9.81
TRACOTHN = drill 1.067: 1 -2.54,10.16; 2 2.54,10.16; 3 -10.16,-7.62; 4 0,-7.62; 5 10.16,-7.62; 6 10.16,10.16
SMA_EDGELAUNCH = smd 4.064 x 1.524: GND@1 2.032,-2.54; GND@2 2.032,2.54 | smd 4.064 x 1.524 bottom: GND@3 2.032,2.54; GND@4 2.032,-2.54 | smd 4.064 x 1.27: P 2.032,0

### Placement (x,y rotation side)
ANT1  7.3,10.8 270 top
ANT2  40.4,8.7 0 top
C1  22.7,12.6 270 top
C2  24.3,12.6 270 top
C3  71.6,34.4 90 top
C4  33.6,28.8 90 top
C5  39.6,28.8 270 top
C6  22.9,27.3 180 top
C7  22.9,25.7 180 top
C8  35.7,42.6 270 top
C9  36.2,46 0 top
C10  18.6,45.6 180 top
C11  26.2,45.9 0 top
C12  8,37.2 0 top
C13  12.7,41.1 90 top
C14  7.4,25.7 90 top
C15  19.7,23.1 270 top
C16  65.7,38.6 90 top
C17  63.3,38.6 90 top
C18  68.1,38.6 90 top
C19  34.1,31.9 180 top
D1  8.1,31 270 top
D2  6,31.1 270 top
D3  1.8,31.1 270 top
D4  3.9,31.1 270 top
D5  64.6,24.9 0 top
D6  17.2,33.4 90 top
D7  76.8,27.4 180 top
D8  63.9,29.8 0 top
D9  82.5,24.5 90 top
D10  20.1,14.9 270 top
F1  81.1,6.2 90 bottom
J1  29,50 180 bottom
J2  32.75,15.45 180 bottom
J3  23.7,51.2 180 top
J4  33.7,51.2 180 top
J5  81.5,14.2 0 top
J6  27.6,2.8 0 top
J7  15.3,2.8 0 top
J8  3.2,42 270 top
PCB1  0,0 0 top
PS1  73.5,5.3 90 top
R1  27.9,29.1 180 top
R2  24.8,29.1 180 top
R3  48.2,38.6 0 top
R4  47.4,32.3 0 top
R5  74,28.4 90 top
R6  76.7,29.4 0 top
R7  64.6,26.6 0 top
R8  63.9,31.5 0 top
R9  47.4,34.4 0 top
R10  47.4,30.1 0 top
R11  47.4,36.5 0 top
R12  20.1,17.9 90 top
R13  30.1,19.8 0 top
R14  30.1,22 0 top
R15  8.1,34.1 90 top
R16  6,34.1 90 top
R17  3.9,34.1 90 top
R18  1.8,34.1 90 top
R19  15,37.9 90 top
R20  17.2,37.9 90 top
R21  19.4,37.9 90 top
S1  54.7,35.5 315 top
S2  12.2,50 180 top
TP1  24,31.6 90 top
TP2  50,3 0 top
TP3  66.8,24 0 top
TP4  33.6,26.3 0 top
TP5  10.1,5.1 0 top
TP6  80.4,43 0 top
TP7  80.4,45.5 0 top
U1  23.9,16.4 90 top
U2  4.8,25.7 270 top
U3  22.3,44.8 270 top
U4  17.1,25.5 270 top
U5  70,28.6 90 top
U6  27.2,26.5 90 top
U7  36.5,28.7 180 top
U8  32.2,44.8 270 top
U9  9.1,41.9 180 top
U$1  77.9,52.8 180 top
U$2  64.9,13.1 180 top
X1  -0.1,10.8 0 top
X2  40.6,-0.2 90 top

### Tracks (layer width: path | path; a pad name or v marks a point on that pad's centre or on a via)
+1V8  (via drill 0.35)
  Top 0.152: R9.2 v49.5,34.4 | R4.2 49,32.3 v49.3,32 | R10.2 49.1,30.1 v49.3,29.9
  Top 0.254: 27,26.75 U6.P$6 25.05,26.75 24.5,27.3 24,27.3 | 27,26.75 U6.P$3 29.09,26.75 29.81,27.47 | C10.1 19.5,45.55 19.5,44.58 19.42,44.5 16.8,44.5 16.48,44.82 U9.1 11,44.77 v11,42.3 | 24,27.3 C6.1 | U9.8 C12.1 6.95,37 v5.8,37 | R1.2 27.05,26.8 27,26.75 | 24,27.3 23.95,27.35 R2.2 24,29.15 TP1.P$1 | v44,45.3 44,41.88 45.58,40.3 v50.4,40.3 | v50.4,39.1 49.9,38.6 R3.2 | R11.2 48.45,36.7 v49.5,36.7
  Top 0.305: 35.7,44.55 U8.P$6 v32.2,44.55 U8.P$3 U3.P$6 U3.P$3 20.45,44.55 20.42,44.58 19.5,44.58
  Top 0.381: v44,45.3 43.25,44.55 35.7,44.55 C8.1 | v32.2,42.9 29.81,40.51 29.81,27.47
  Bottom 0.152: v49.5,36.7 v49.5,34.4 49.3,34.2 v49.3,32 v49.3,29.9
  Bottom 0.254: v5.8,37 11,42.2 v11,42.3 | v50.4,40.3 v50.4,39.1 50.4,37.6 v49.5,36.7
  Bottom 0.381: J1.P$35 v44,45.3 | v32.2,44.55 v32.2,42.9
+3V3  (via drill 0.35)
  Top 0.2: U1.8 22.75,15.25
  Top 0.254: R13.2 R14.2 31.15,22 | U2.5 3.8,25.8 4.3,25.3 4.3,24.9 | U2.7 4.3,24.9 | 4.3,24.9 5.4,24.9 5.8,24.5 | 5.8,24.5 U2.10 5.8,22.86 5.94,22.71 10.16,22.71 10.59,23.14 10.59,24.84 11.66,25.91 16.79,25.91 18.1,24.6 18.1,23.8 | 18.1,23.8 U4.10 18.1,21.5 18.8,20.8 25.02,20.8 v25.62,21.4 v25.62,23.4 25.62,24.48 25.15,24.95 25.15,25.7 | v32.55,23.4 32.6,23.4 | U3.P$7 25.3,45.05 | 25.3,45.05 29.45,45.05 29.7,45.3 v29.8,45.3 | 25.15,25.7 25.15,25.99 25.41,26.25 U6.P$7 | 32.9,42.5 v33,42.5 | 33.8,27.75 C4.1 | U7.5 34.9,27.5 | C11.1 25.35,45.1 25.3,45.05 | C9.1 35.35,45.15 35.3,45.1 35.25,45.05 U8.P$7 32.76,45.05 v32.5,45.31 | C7.1 25.15,25.7 | U1.8 C1.1 C2.1 U1.6 | 22.75,15.25 22.7,15.3 22.7,16.3 23.5,17.1 U1.2 v23.5,19.3 | C15.1 19.55,23.8 18.1,23.8 | C14.1 7.05,24.5 5.8,24.5
  Top 0.305: v23.5,19.3 21.8,19.3 21.25,18.75 R12.2
  Top 0.406: 31.15,22 v32.55,23.4 | 32.6,23.4 34.9,25.7 34.9,27.5 | 32.9,42.5 30.42,40.02 30.42,28.6 31.07,27.95 C4.1 | U7.5 33.8,27.75 | 35.3,45.1 42.7,45.1 43.7,46.1 72.83,46.1 74.8,48.07 U$1.3V3
  Top 0.508: TP4.P$1 C4.1
  Bottom 0.254: v32.5,45.31 v32.49,45.3 v32.5,45.3 | v23.5,19.3 25.6,21.4 v25.62,21.4
  Bottom 0.406: v25.62,23.4 v32.55,23.4 | v33,42.5 33,44.8 v32.5,45.3 | v29.8,45.3 v32.49,45.3
+5V  (via drill 0.35, 0.5)
  Top 0.254: U7.1 37.8,27.7 | J8.1 5.67,45.12 11.05,39.75 U9.14 12.38,38.98 12.7,39.3 C13.1 12.7,39 13.32,38.38
  Top 0.305: J7.1 13.43,3.38 15.2,1.6 v17.7,1.6 | 25.7,5.05 J6.1
  Top 0.406: R6.1 75.7,29.25 R5.2 72.25,29.25 71.61,29.89 71.61,30.44 71.62,30.45 U5.10 71.62,33.52 C3.1 70.65,33.55 70.2,34 70.2,42.8 67.8,45.2 v46,45.2 | v25.7,1.6 25.7,5.05 | J6.1 v25.73,7.92 | R18.2 R17.2 R16.2 R15.2 9.9,34.95 13.32,38.38 13.7,38.75 R19.2 R20.2 R21.2 19.4,40.5 20,41.1 v26.8,41.1 26.9,41.1 28.12,39.88 v28.12,39.4 | 37.8,27.7 37.8,23.61 28.1,13.9 v28.1,7.9 | v46,49.1 45.6,48.7 35.5,48.7 35.42,48.77 J4.1 35.58,49.92 35.17,50.33 25.98,50.33 25.57,49.92 J3.1 26.48,48.92 v26.5,48.9 | v31.1,39.4 31.1,38.1 36.5,32.7 36.5,29.6 | U7.1 37.15,27.75 36.5,28.4 36.5,29.6 | U7.3 36.55,29.65 36.5,29.6
  Top 0.508: TP5.P$1 13.4,5.1 J7.1
  Top 0.61: U7.3 C5.1
  Bottom 0.254: v28.1,7.9 28.07,7.92 | v26.5,48.9 26.55,48.9 | v26.8,41.1 26.78,41.12 26.78,48.67
  Bottom 0.406: v46,49.1 J1.P$37 v46,45.2 | v17.7,1.6 v25.7,1.6 | v25.73,7.92 28.07,7.92 | v31.1,39.4 v28.12,39.4 | 26.78,48.67 26.55,48.9
+12V
  Top 0.406: U5.3 69.03,27.23 70.33,28.52 U5.12 | R7.2 67.3,26.6 67.72,26.18 U5.1
  Top 0.508: TP3.P$1 68.2,24
  Top 1.016: 73.6,10.38 PS1.3
  pour Top (no thermals): 67.6,26.32 69.2,26.32 69.2,23.62 76.48,23.62 77.6,22.5 77.6,10.7 76.2,9.3 72.7,9.3 67.6,14.4
CS
  Top 0.254: J8.3 6.83,42.62 9.75,39.7 U9.12
EXT_VIN
  Top 0.813: J5.1 82.77,15.37 84,16.6 84,19.8 82.5,21.3 D9.C
  Bottom 0.813: F1.2 81.1,10.3 82.8,12 82.8,14.17 J5.1
GND  (via drill 0.35)
  other vias: 31.3,46.3 29.6,26.3 33.6,30.8 10.1,37.2 12.7,43.1
  pour Top (rank 2): 0.2,53.8 85.1,53.8 85.1,-0.2 0,-0.2 0,53.8
  pour Bottom (rank 2): 0,54 84.9,54 84.9,0 0,0
GPIO-G  (via drill 0.35)
  Top 0.254: v38,43.3 44.49,36.81 44.49,33.93 44.5,33.92 44.5,32.3 45.7,31.1 46.5,31.1 | S1.B 59.2,32.98 59.2,31.4 57,29.2 51.2,29.2 49.3,31.1 46.5,31.1 | R10.1 46.55,31.05 46.5,31.1
  Bottom 0.254: J1.P$29 v38,43.3
GPIO-I  (via drill 0.35)
  Top 0.254: v40,43.3 45.4,37.9 45.4,36 45.8,35.6 46.5,35.6 | S1.C 50.1,35.6 46.5,35.6 | R9.1 46.5,34.45 46.5,35.6
  Bottom 0.254: J1.P$31 v40,43.3
GPIO-J  (via drill 0.35)
  Top 0.254: v39,43.3 44.9,37.4 44.9,34.1 45.8,33.2 46.5,33.2 | S1.D 57.2,31 57.2,30 56.81,29.61 51.49,29.61 50,31.1 50,32.4 49.2,33.2 46.5,33.2 | R4.1 46.5,32.35 46.5,33.2
  Bottom 0.254: J1.P$32 40,49.7 39,48.7 v39,43.3
GPIO-K  (via drill 0.35)
  Top 0.254: v42,43.3 45.6,39.7 47.3,39.7 | S1.A 52.48,39.7 47.3,39.7 | R3.1 47.35,39.65 47.3,39.7
  Bottom 0.254: J1.P$33 v42,43.3
GPIO-L  (via drill 0.35)
  Top 0.254: v41,43.3 46.65,37.65 | S1.CTR 51.7,38.5 50.5,38.5 49.7,37.7 46.7,37.7 46.65,37.65 | 46.65,37.65 46.65,36.6 R11.1
  Bottom 0.254: J1.P$34 42,50 41,49 v41,43.3
I2C1_SCL  (via drill 0.35)
  Top 0.254: U6.P$4 28.75,27.35 R1.1 28.75,29.65 29.34,30.24 29.34,41.43 29.18,41.59 v29.18,42.1
  Bottom 0.254: J1.P$19 v28,42.8 28.02,42.78 28.02,42.36 28.28,42.1 v29.18,42.1
I2C1_SDA  (via drill 0.35)
  Top 0.254: v28.8,42.8 28.6,42.6 28.6,41.8 28.6,41.6 28.8,41.4 28.8,30.5 28.3,30 26,30 25.6,29.6 25.6,29.15 R2.1 25.75,29 U6.P$5
  Bottom 0.254: J1.P$21 30,46.5 28.8,45.3 v28.8,42.8
MISO
  Top 0.254: J8.4 7.42,41.38 9.1,39.7 U9.11
MOSI
  Top 0.254: J8.5 7.78,40.12 8.45,39.45 U9.10
N$1
  Top 0.406: U5.7 71.62,26.82 72.35,27.55 R5.1 75.77,27.55 D7.C
N$2
  Top 0.813: ANT1.SIG X1.P
N$3
  Top 0.305: D1.A R15.1
N$4
  Top 0.305: D2.A R16.1
N$5
  Top 0.305: D4.A R17.1
N$6
  Top 0.305: D3.A R18.1
N$7
  Top 0.406: R6.2 77.68,29.27 D7.A
N$8
  Top 0.406: R19.1 15,36.17 D6.6
N$9
  Top 0.406: R20.1 D6.5
N$10
  Top 0.813: X2.P 40.6,6.97 ANT2.SIG
N$11
  Top 0.406: R21.1 19.4,36.17 D6.4
N$12  (via drill 0.35)
  Top 0.254: X2.GND@2 36.83,1.83 v36.8,1.8 | v44.5,1.9 44.43,1.83 X2.GND@1
  Top 0.813: X2.GND@2 38.06,7.83 ANT2.GND1 39.6,8.7 | ANT2.GND2 43.14,7.43 X2.GND@1
  Top 1.016: ANT2.GND2 39.6,8.7
  Bottom 0.254: v36.8,1.8 36.83,1.83 X2.GND@2 | X2.GND@1 44.43,1.83 v44.5,1.9
N$13
  Top 0.406: R7.1 63.75,24.93 D5.A
N$14  (via drill 0.35)
  Top 0.254: X1.GND@2 1.93,14.57 v1.9,14.6 | v1.9,7 1.9,8.23 X1.GND@1
  Top 0.813: ANT1.GND1 6.24,13.34 X1.GND@2 | ANT1.GND2 6.24,8.26 X1.GND@1
  Top 1.016: ANT1.GND2 ANT1.GND1
  Bottom 0.254: v1.9,14.6 1.93,14.57 X1.GND@2 | X1.GND@1 1.93,7.03 v1.9,7
N$15
  Top 0.406: R8.1 63.02,31.47 D8.A
N$16
  Top 0.508: U7.4 35.15,31.7 C19.1
N$17
  Top 0.508: R12.1 D10.A
N$21
  Top 0.254: U2.1 5.8,28.6 6,28.8 7.1,28.8 8.1,29.8 D1.C
N$22
  Top 0.254: U2.2 5.3,29.52 D2.C
N$23
  Top 0.254: U3.P$8 24.32,46.12 J3.2
N$24
  Top 0.254: U3.P$1 22.05,45.55 23.07,46.58 J3.3
N$25
  Top 0.254: D4.C 4.8,29.32 U2.3
N$26
  Top 0.254: D3.C 3.12,28.9 4,28.9 4.3,28.6 U2.4
N$27
  Top 0.508: TP2.P$1 54.68,3 U$2.6
  Bottom 0.813: F1.1 77.8,2.5 75,5.3 PS1.1 69.8,5.3 U$2.1 67.4,2.9 65.4,2.9 63.5,4.8 61.1,4.8 59.24,2.94 U$2.6
N$28
  Top 0.305: D6.1 16.3,30.1 17.1,29.3 U4.3
N$29
  Top 0.305: D6.2 17.2,30 17.6,29.6 U4.2
N$30
  Top 0.305: D6.3 U4.1
N$31
  Top 0.254: J4.2 34.33,46.23 U8.P$8
N$34
  Top 0.254: U8.P$1 31.37,45.55 33.08,47.25 J4.3
RST_BTN_N  (via drill 0.5)
  Top 0.406: S2.A2 12.85,52.25 v13.95,51.15
  Bottom 0.406: v13.95,51.15 14,51.2 J1.P$6
SCL_3V3  (via drill 0.35)
  Top 0.254: 26.98,19.8 v26.3,19.8 26.2,19.9 18.55,19.9 17.1,21.35 U4.8 17.1,24.4 16.4,25.1 12,25.1 11.4,24.5 11.4,22.8 10.5,21.9 5.4,21.9 4.8,22.5 U2.8 | v72.27,30.16 72.27,31.46 U5.9 73.5,32.7 73.5,44.13 74.9,45.53 76.2,45.53 U$1.SCL | 26.98,24.27 v26.82,24.27 | v28.2,24.3 28.7,24.8 28.7,25.7 U6.P$1 | v66.2,28.7 66.1,28.7 65.75,28.35 43.65,28.35 v35.1,19.8 | R13.1 v28.2,19.8 | v25.3,19.3 25.1,19.1 U1.4
  Top 0.305: J7.2 14.68,3.83 16,2.5 v17.7,2.5 | v27,2.5 27,5.05 J6.2 26.98,19.8 26.98,24.27
  Top 0.508: TP7.P$1 76.23,45.5 76.2,45.53
  Bottom 0.254: v72.27,30.16 71.9,29.8 67.3,29.8 v66.2,28.7 | v28.2,24.3 26.85,24.3 v26.82,24.27 | v35.1,19.8 v28.2,19.8 v26.3,19.8 25.8,19.3 v25.3,19.3
  Bottom 0.305: v17.7,2.5 v27,2.5
SCLK
  Top 0.254: J8.2 6.15,43.88 10.4,39.62 U9.13
SDA_3V3  (via drill 0.35)
  Top 0.254: 27.43,22 v28,22 R14.1 | v76.4,26.13 72.28,26.13 U5.8 72.3,25.7 v72.3,24.2 | U2.9 5.3,22.61 5.6,22.31 10.33,22.31 10.99,22.97 10.99,24.67 11.83,25.51 16.57,25.51 17.53,24.55 17.53,23.43 U4.9 17.6,21.43 18.63,20.39 25.53,20.39 26.2,21.06 v26.2,22 | v76.4,30.6 76.4,42.9 U$1.SDA | U6.P$8 27.05,25.75 27.41,25.39 27.41,24.12 27.43,24.1 | v66.2,27.94 44.14,27.94 v37.95,21.75 v37.96,21.74 | U1.3 24.3,19.2 v24.4,19.3
  Top 0.305: J7.3 15.93,3.98 16.5,3.4 v17.7,3.4 | v28.2,3.4 28.2,5.05 J6.3 28.23,6.78 27.43,7.57 27.43,22 27.43,24.1
  Top 0.508: TP6.P$1 76.5,43 76.4,42.9
  Bottom 0.254: v76.4,30.6 v76.4,26.13 | v72.3,24.2 69.94,24.2 v66.2,27.94 | v37.96,21.74 28.26,21.74 v28,22 v26.2,22 26.2,21.1 v24.4,19.3
  Bottom 0.305: v17.7,3.4 v28.2,3.4
SPI0_CS  (via drill 0.35)
  Top 0.254: v20,50.1 19.2,49.3 13.8,49.3 9.75,45.25 U9.3
  Bottom 0.254: J1.P$12 v20,50.1
SPI0_DIN  (via drill 0.35)
  Top 0.254: v18,50.3 17.41,49.71 13.43,49.71 9.12,45.39 9.12,44.84 U9.4
  Bottom 0.254: J1.P$10 v18,50.3
SPI0_DOUT  (via drill 0.35)
  Top 0.254: v22,50.7 20.1,48.8 15,48.8 14.9,48.8 13.9,48.8 10.4,45.3 U9.2
  Bottom 0.254: J1.P$14 v22,50.7
SPI0_SCLK  (via drill 0.35)
  Top 0.254: v16,50.4 15.9,50.3 13.4,50.3 8.45,45.35 U9.5
  Bottom 0.254: J1.P$8 v16,50.4
SYS_DCIN  (via drill 0.5)
  Top 0.406: v66.5,31.6 66.4,31.5 R8.2
  Top 1.27: C17.1 C16.1 C18.1 68.1,35.4 v67.6,34.9
  other vias: 66.5,34.9 68.7,34.9 68.7,33.8 67.6,33.8 66.5,33.8 66.5,32.7
  pour Bottom (isolate 0.254, no thermals): 43.2,53.4 43.2,50.08 66.2,50.31 66.1,35.4 66.2,30.6 69.3,30.5 69.4,51.2 48.9,51.2 47.1,51.3 47.1,53.6
  pour Top (no thermals): 69.2,30.6 66.5,30.6 66.1,31 66.1,35.4 66.2,35.5 69.2,35.5
UART0_RXD  (via drill 0.35)
  Top 0.254: U3.P$4 16.15,44.05 v16.1,44
  Bottom 0.254: v16.1,44 16.1,47.4 J1.P$7
UART0_TXD  (via drill 0.35)
  Top 0.254: U3.P$5 21.85,44.05 21.22,43.42 14.08,43.42 v14,43.5
  Bottom 0.254: v14,43.5 J1.P$5
UART1_RXD  (via drill 0.35)
  Top 0.254: U8.P$4 27.45,44.05 26.7,43.3 v22,43.3
  Bottom 0.254: v22,43.3 J1.P$13
UART1_TXD  (via drill 0.35)
  Top 0.254: U8.P$5 33.2,43.6 27.82,43.6 26.94,42.72 20.02,42.72 v20,42.7
  Bottom 0.254: v20,42.7 J1.P$11

### Text on the board
tPlace: +5V | SCLK | CS | MISO | MOSI | GND | UART0 | UART1 | RESET | SCL | Input: +15-33V (4-6S) | TXS0102 | TXS0102 | SDA | GND | RX0 | TX0 | +5V | GND | RX1 | TX1 | +5V | 1V8 | INA260 | SYS DCIN | Power Monitor | 1V8 PULLUP | RGB | 12V | WARN | 3V3 | TPS73633 | 3V3 LDO | TXS0102 | 12V | PCA9632 | PCA9632 | 3V3 PULLUP | LJMU Astro Eco | 96 Boards Carrier | 3V3 | - | + | +5V | SCL | SDA | GND | +5V | SCL | SDA | GND | 5V | EXT VIN | 2020-JVM-R1 | 3V3 Logic! | 3V3 Logic!